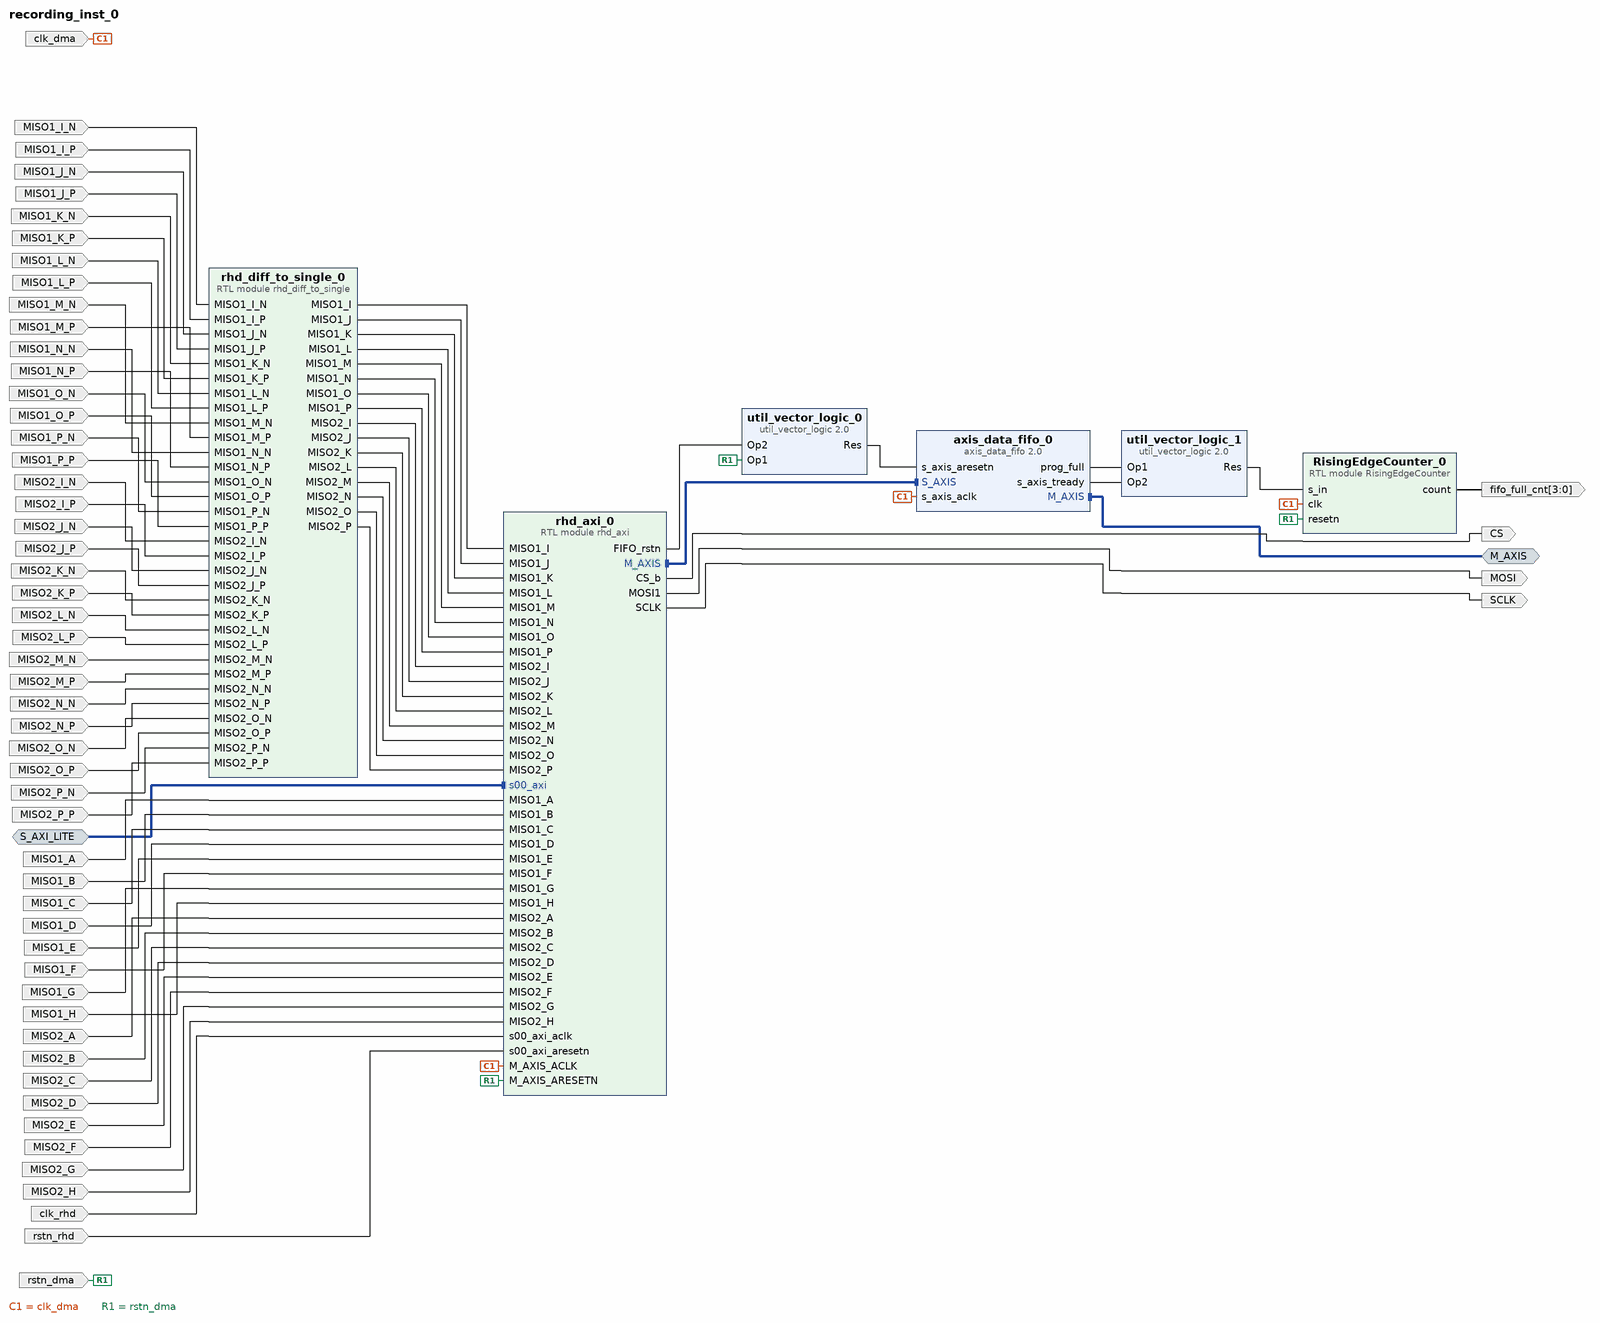
[diagram p0: block diagram of the top level]
# Vivado block design recording_inst_0, xck26-sfvc784-2LV-c, Vivado 2023.1
create_bd_design recording_inst_0

create_bd_intf_port -mode Master -vlnv xilinx.com:interface:axis_rtl:1.0 M_AXIS
create_bd_intf_port -mode Slave -vlnv xilinx.com:interface:aximm_rtl:1.0 S_AXI_LITE
create_bd_port -dir O CS
create_bd_port -dir I MISO1_A
create_bd_port -dir I MISO1_B
create_bd_port -dir I MISO1_C
create_bd_port -dir I MISO1_D
create_bd_port -dir I MISO1_E
create_bd_port -dir I MISO1_F
create_bd_port -dir I MISO1_G
create_bd_port -dir I MISO1_H
create_bd_port -dir I MISO2_A
create_bd_port -dir I MISO2_B
create_bd_port -dir I MISO2_C
create_bd_port -dir I MISO2_D
create_bd_port -dir I MISO2_E
create_bd_port -dir I MISO2_F
create_bd_port -dir I MISO2_G
create_bd_port -dir I MISO2_H
create_bd_port -dir O MOSI
create_bd_port -dir O SCLK
create_bd_port -dir I -type clk clk_dma
create_bd_port -dir I -type clk clk_rhd
create_bd_port -dir O -from 3 -to 0 fifo_full_cnt
create_bd_port -dir I -type rst rstn_dma
create_bd_port -dir I -type rst rstn_rhd
create_bd_port -dir I MISO1_I_P
create_bd_port -dir I MISO1_I_N
create_bd_port -dir I MISO2_I_P
create_bd_port -dir I MISO2_I_N
create_bd_port -dir I MISO1_J_P
create_bd_port -dir I MISO1_J_N
create_bd_port -dir I MISO2_J_P
create_bd_port -dir I MISO2_J_N
create_bd_port -dir I MISO1_K_P
create_bd_port -dir I MISO1_K_N
create_bd_port -dir I MISO2_K_P
create_bd_port -dir I MISO2_K_N
create_bd_port -dir I MISO1_L_P
create_bd_port -dir I MISO1_L_N
create_bd_port -dir I MISO2_L_P
create_bd_port -dir I MISO2_L_N
create_bd_port -dir I MISO1_M_P
create_bd_port -dir I MISO1_M_N
create_bd_port -dir I MISO2_M_P
create_bd_port -dir I MISO2_M_N
create_bd_port -dir I MISO1_N_P
create_bd_port -dir I MISO1_N_N
create_bd_port -dir I MISO2_N_P
create_bd_port -dir I MISO2_N_N
create_bd_port -dir I MISO1_O_P
create_bd_port -dir I MISO1_O_N
create_bd_port -dir I MISO2_O_P
create_bd_port -dir I MISO2_O_N
create_bd_port -dir I MISO1_P_P
create_bd_port -dir I MISO1_P_N
create_bd_port -dir I MISO2_P_P
create_bd_port -dir I MISO2_P_N

create_bd_cell -type ip -vlnv xilinx.com:ip:axis_data_fifo:2.0 axis_data_fifo_0
set_property -dict [list \
  CONFIG.FIFO_DEPTH 32768 \
  CONFIG.HAS_PROG_FULL 1 \
  CONFIG.HAS_TLAST 1 \
  CONFIG.TDATA_NUM_BYTES 8 \
] [get_bd_cells axis_data_fifo_0]
create_bd_cell -type ip -vlnv xilinx.com:ip:util_vector_logic:2.0 util_vector_logic_0
set_property -dict {CONFIG.C_SIZE 1} [get_bd_cells util_vector_logic_0]
create_bd_cell -type ip -vlnv xilinx.com:ip:util_vector_logic:2.0 util_vector_logic_1
set_property -dict {CONFIG.C_SIZE 1} [get_bd_cells util_vector_logic_1]
create_bd_cell -type module -reference RisingEdgeCounter RisingEdgeCounter_0
create_bd_cell -type module -reference rhd_diff_to_single rhd_diff_to_single_0
create_bd_cell -type module -reference rhd_axi rhd_axi_0

# ---- connections ----

connect_bd_intf_net [get_bd_intf_pins rhd_axi_0/s00_axi] [get_bd_intf_ports S_AXI_LITE]
connect_bd_intf_net [get_bd_intf_pins axis_data_fifo_0/M_AXIS] [get_bd_intf_ports M_AXIS]
connect_bd_intf_net [get_bd_intf_pins rhd_axi_0/M_AXIS] [get_bd_intf_pins axis_data_fifo_0/S_AXIS]
connect_bd_net [get_bd_ports MISO1_A] [get_bd_pins rhd_axi_0/MISO1_A]
connect_bd_net [get_bd_ports MISO1_B] [get_bd_pins rhd_axi_0/MISO1_B]
connect_bd_net [get_bd_ports MISO1_C] [get_bd_pins rhd_axi_0/MISO1_C]
connect_bd_net [get_bd_ports MISO1_D] [get_bd_pins rhd_axi_0/MISO1_D]
connect_bd_net [get_bd_ports MISO1_E] [get_bd_pins rhd_axi_0/MISO1_E]
connect_bd_net [get_bd_ports MISO1_F] [get_bd_pins rhd_axi_0/MISO1_F]
connect_bd_net [get_bd_ports MISO1_G] [get_bd_pins rhd_axi_0/MISO1_G]
connect_bd_net [get_bd_ports MISO1_H] [get_bd_pins rhd_axi_0/MISO1_H]
connect_bd_net [get_bd_ports MISO1_I_N] [get_bd_pins rhd_diff_to_single_0/MISO1_I_N]
connect_bd_net [get_bd_ports MISO1_I_P] [get_bd_pins rhd_diff_to_single_0/MISO1_I_P]
connect_bd_net [get_bd_ports MISO1_J_N] [get_bd_pins rhd_diff_to_single_0/MISO1_J_N]
connect_bd_net [get_bd_ports MISO1_J_P] [get_bd_pins rhd_diff_to_single_0/MISO1_J_P]
connect_bd_net [get_bd_ports MISO1_K_N] [get_bd_pins rhd_diff_to_single_0/MISO1_K_N]
connect_bd_net [get_bd_ports MISO1_K_P] [get_bd_pins rhd_diff_to_single_0/MISO1_K_P]
connect_bd_net [get_bd_ports MISO1_L_N] [get_bd_pins rhd_diff_to_single_0/MISO1_L_N]
connect_bd_net [get_bd_ports MISO1_L_P] [get_bd_pins rhd_diff_to_single_0/MISO1_L_P]
connect_bd_net [get_bd_ports MISO1_M_N] [get_bd_pins rhd_diff_to_single_0/MISO1_M_N]
connect_bd_net [get_bd_ports MISO1_M_P] [get_bd_pins rhd_diff_to_single_0/MISO1_M_P]
connect_bd_net [get_bd_ports MISO1_N_N] [get_bd_pins rhd_diff_to_single_0/MISO1_N_N]
connect_bd_net [get_bd_ports MISO1_N_P] [get_bd_pins rhd_diff_to_single_0/MISO1_N_P]
connect_bd_net [get_bd_ports MISO1_O_N] [get_bd_pins rhd_diff_to_single_0/MISO1_O_N]
connect_bd_net [get_bd_ports MISO1_O_P] [get_bd_pins rhd_diff_to_single_0/MISO1_O_P]
connect_bd_net [get_bd_ports MISO1_P_N] [get_bd_pins rhd_diff_to_single_0/MISO1_P_N]
connect_bd_net [get_bd_ports MISO1_P_P] [get_bd_pins rhd_diff_to_single_0/MISO1_P_P]
connect_bd_net [get_bd_ports MISO2_A] [get_bd_pins rhd_axi_0/MISO2_A]
connect_bd_net [get_bd_ports MISO2_B] [get_bd_pins rhd_axi_0/MISO2_B]
connect_bd_net [get_bd_ports MISO2_C] [get_bd_pins rhd_axi_0/MISO2_C]
connect_bd_net [get_bd_ports MISO2_D] [get_bd_pins rhd_axi_0/MISO2_D]
connect_bd_net [get_bd_ports MISO2_E] [get_bd_pins rhd_axi_0/MISO2_E]
connect_bd_net [get_bd_ports MISO2_F] [get_bd_pins rhd_axi_0/MISO2_F]
connect_bd_net [get_bd_ports MISO2_G] [get_bd_pins rhd_axi_0/MISO2_G]
connect_bd_net [get_bd_ports MISO2_H] [get_bd_pins rhd_axi_0/MISO2_H]
connect_bd_net [get_bd_ports MISO2_I_N] [get_bd_pins rhd_diff_to_single_0/MISO2_I_N]
connect_bd_net [get_bd_ports MISO2_I_P] [get_bd_pins rhd_diff_to_single_0/MISO2_I_P]
connect_bd_net [get_bd_ports MISO2_J_N] [get_bd_pins rhd_diff_to_single_0/MISO2_J_N]
connect_bd_net [get_bd_ports MISO2_J_P] [get_bd_pins rhd_diff_to_single_0/MISO2_J_P]
connect_bd_net [get_bd_ports MISO2_K_N] [get_bd_pins rhd_diff_to_single_0/MISO2_K_N]
connect_bd_net [get_bd_ports MISO2_K_P] [get_bd_pins rhd_diff_to_single_0/MISO2_K_P]
connect_bd_net [get_bd_ports MISO2_L_N] [get_bd_pins rhd_diff_to_single_0/MISO2_L_N]
connect_bd_net [get_bd_ports MISO2_L_P] [get_bd_pins rhd_diff_to_single_0/MISO2_L_P]
connect_bd_net [get_bd_ports MISO2_M_N] [get_bd_pins rhd_diff_to_single_0/MISO2_M_N]
connect_bd_net [get_bd_ports MISO2_M_P] [get_bd_pins rhd_diff_to_single_0/MISO2_M_P]
connect_bd_net [get_bd_ports MISO2_N_N] [get_bd_pins rhd_diff_to_single_0/MISO2_N_N]
connect_bd_net [get_bd_ports MISO2_N_P] [get_bd_pins rhd_diff_to_single_0/MISO2_N_P]
connect_bd_net [get_bd_ports MISO2_O_N] [get_bd_pins rhd_diff_to_single_0/MISO2_O_N]
connect_bd_net [get_bd_ports MISO2_O_P] [get_bd_pins rhd_diff_to_single_0/MISO2_O_P]
connect_bd_net [get_bd_ports MISO2_P_N] [get_bd_pins rhd_diff_to_single_0/MISO2_P_N]
connect_bd_net [get_bd_ports MISO2_P_P] [get_bd_pins rhd_diff_to_single_0/MISO2_P_P]
connect_bd_net [get_bd_pins RisingEdgeCounter_0/count] [get_bd_ports fifo_full_cnt]
connect_bd_net [get_bd_pins axis_data_fifo_0/prog_full] [get_bd_pins util_vector_logic_1/Op1]
connect_bd_net [get_bd_pins axis_data_fifo_0/s_axis_tready] [get_bd_pins util_vector_logic_1/Op2]
connect_bd_net [get_bd_ports clk_dma] \
  [get_bd_pins axis_data_fifo_0/s_axis_aclk] [get_bd_pins RisingEdgeCounter_0/clk] [get_bd_pins rhd_axi_0/M_AXIS_ACLK]
connect_bd_net [get_bd_ports clk_rhd] [get_bd_pins rhd_axi_0/s00_axi_aclk]
connect_bd_net [get_bd_pins rhd_axi_0/CS_b] [get_bd_ports CS]
connect_bd_net [get_bd_pins rhd_axi_0/FIFO_rstn] [get_bd_pins util_vector_logic_0/Op2]
connect_bd_net [get_bd_pins rhd_axi_0/MOSI1] [get_bd_ports MOSI]
connect_bd_net [get_bd_pins rhd_axi_0/SCLK] [get_bd_ports SCLK]
connect_bd_net [get_bd_pins rhd_diff_to_single_0/MISO1_I] [get_bd_pins rhd_axi_0/MISO1_I]
connect_bd_net [get_bd_pins rhd_diff_to_single_0/MISO1_J] [get_bd_pins rhd_axi_0/MISO1_J]
connect_bd_net [get_bd_pins rhd_diff_to_single_0/MISO1_K] [get_bd_pins rhd_axi_0/MISO1_K]
connect_bd_net [get_bd_pins rhd_diff_to_single_0/MISO1_L] [get_bd_pins rhd_axi_0/MISO1_L]
connect_bd_net [get_bd_pins rhd_diff_to_single_0/MISO1_M] [get_bd_pins rhd_axi_0/MISO1_M]
connect_bd_net [get_bd_pins rhd_diff_to_single_0/MISO1_N] [get_bd_pins rhd_axi_0/MISO1_N]
connect_bd_net [get_bd_pins rhd_diff_to_single_0/MISO1_O] [get_bd_pins rhd_axi_0/MISO1_O]
connect_bd_net [get_bd_pins rhd_diff_to_single_0/MISO1_P] [get_bd_pins rhd_axi_0/MISO1_P]
connect_bd_net [get_bd_pins rhd_diff_to_single_0/MISO2_I] [get_bd_pins rhd_axi_0/MISO2_I]
connect_bd_net [get_bd_pins rhd_diff_to_single_0/MISO2_J] [get_bd_pins rhd_axi_0/MISO2_J]
connect_bd_net [get_bd_pins rhd_diff_to_single_0/MISO2_K] [get_bd_pins rhd_axi_0/MISO2_K]
connect_bd_net [get_bd_pins rhd_diff_to_single_0/MISO2_L] [get_bd_pins rhd_axi_0/MISO2_L]
connect_bd_net [get_bd_pins rhd_diff_to_single_0/MISO2_M] [get_bd_pins rhd_axi_0/MISO2_M]
connect_bd_net [get_bd_pins rhd_diff_to_single_0/MISO2_N] [get_bd_pins rhd_axi_0/MISO2_N]
connect_bd_net [get_bd_pins rhd_diff_to_single_0/MISO2_O] [get_bd_pins rhd_axi_0/MISO2_O]
connect_bd_net [get_bd_pins rhd_diff_to_single_0/MISO2_P] [get_bd_pins rhd_axi_0/MISO2_P]
connect_bd_net [get_bd_ports rstn_dma] \
  [get_bd_pins util_vector_logic_0/Op1] [get_bd_pins RisingEdgeCounter_0/resetn] [get_bd_pins rhd_axi_0/M_AXIS_ARESETN]
connect_bd_net [get_bd_ports rstn_rhd] [get_bd_pins rhd_axi_0/s00_axi_aresetn]
connect_bd_net [get_bd_pins util_vector_logic_0/Res] [get_bd_pins axis_data_fifo_0/s_axis_aresetn]
connect_bd_net [get_bd_pins util_vector_logic_1/Res] [get_bd_pins RisingEdgeCounter_0/s_in]

# ---- address map ----
assign_bd_address -offset 0x0000 -range 64K -target_address_space [get_bd_addr_spaces S_AXI_LITE] [get_bd_addr_segs rhd_axi_0/s00_axi/reg0]

validate_bd_design
save_bd_design
